# Altium schematic sheet volumes.SchDoc
size A
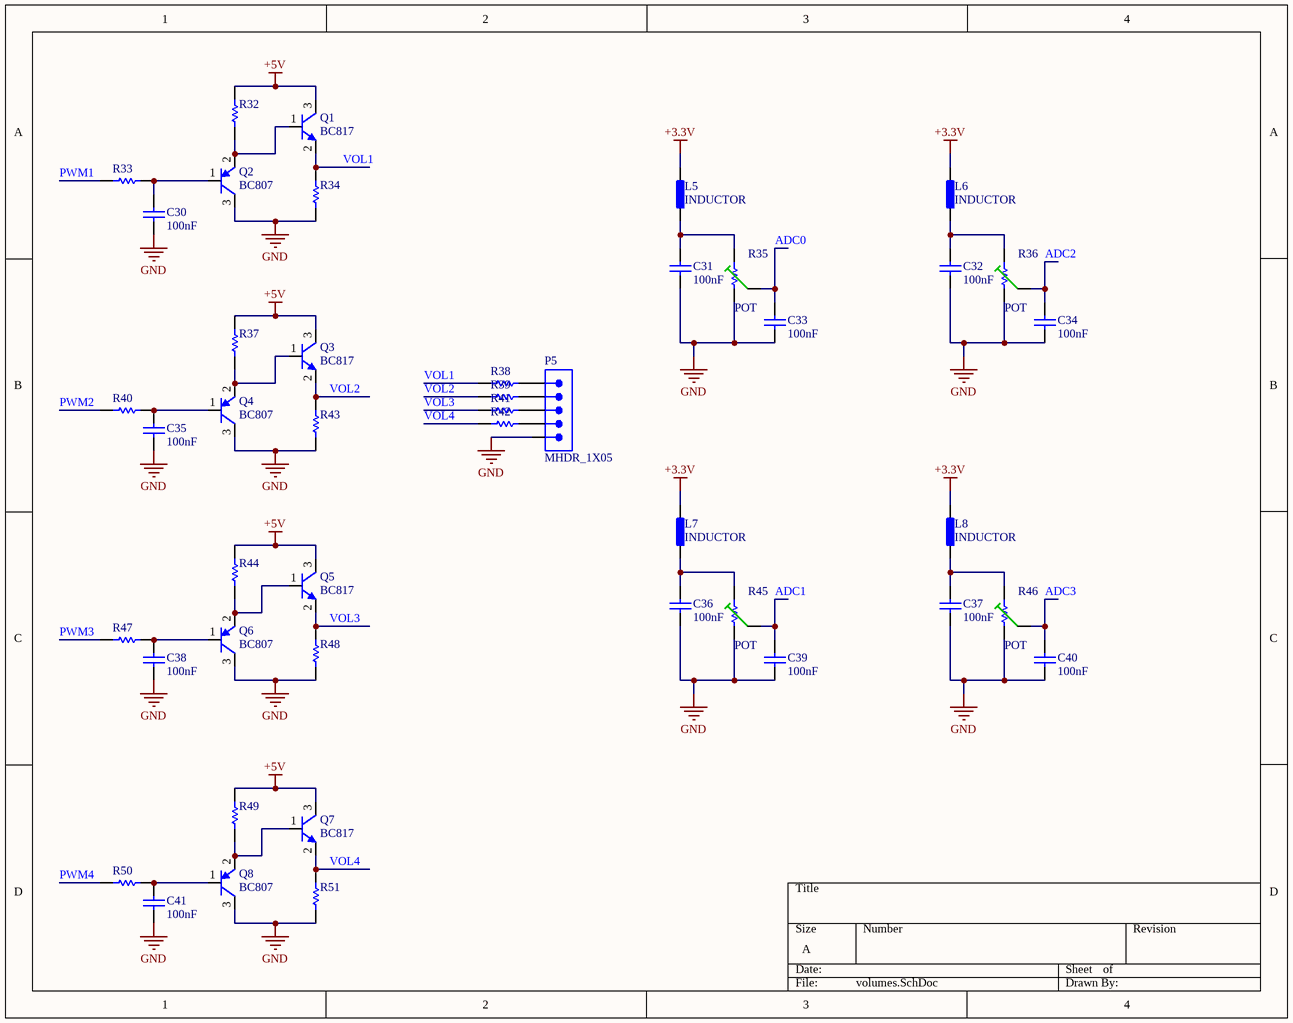
[diagram p0: volumes.SchDoc]

## Parts
C30  100nF  [CAPC3216M (1206)]
C31  100nF  [CAPC3216M (1206)]
C32  100nF  [CAPC3216M (1206)]
C33  100nF  [CAPC3216M (1206)]
C34  100nF  [CAPC3216M (1206)]
C35  100nF  [CAPC3216M (1206)]
C36  100nF  [CAPC3216M (1206)]
C37  100nF  [CAPC3216M (1206)]
C38  100nF  [CAPC3216M (1206)]
C39  100nF  [CAPC3216M (1206)]
C40  100nF  [CAPC3216M (1206)]
C41  100nF  [CAPC3216M (1206)]
L5  INDUCTOR  [INDC3216]
L6  INDUCTOR  [INDC3216]
L7  INDUCTOR  [INDC3216]
L8  INDUCTOR  [INDC3216]
P5  MHDR_1X05  [MHDR1X05-254P]
Q1  BC817  [SOT23_BEC_M]
Q2  BC807  [SOT23_BEC_M]
Q3  BC817  [SOT23_BEC_M]
Q4  BC807  [SOT23_BEC_M]
Q5  BC817  [SOT23_BEC_M]
Q6  BC807  [SOT23_BEC_M]
Q7  BC817  [SOT23_BEC_M]
Q8  BC807  [SOT23_BEC_M]
R32  1K  [RESC3216X60M (1206)]  (value not drawn)
R33  1K  [RESC3216X60M (1206)]  (value not drawn)
R34  1K  [RESC3216X60M (1206)]  (value not drawn)
R35  POT  [EVUF]
R36  POT  [EVUF]
R37  1K  [RESC3216X60M (1206)]  (value not drawn)
R38  1K  [RESC3216X60M (1206)]  (value not drawn)
R39  1K  [RESC3216X60M (1206)]  (value not drawn)
R40  1K  [RESC3216X60M (1206)]  (value not drawn)
R41  1K  [RESC3216X60M (1206)]  (value not drawn)
R42  1K  [RESC3216X60M (1206)]  (value not drawn)
R43  1K  [RESC3216X60M (1206)]  (value not drawn)
R44  1K  [RESC3216X60M (1206)]  (value not drawn)
R45  POT  [EVUF]
R46  POT  [EVUF]
R47  1K  [RESC3216X60M (1206)]  (value not drawn)
R48  1K  [RESC3216X60M (1206)]  (value not drawn)
R49  1K  [RESC3216X60M (1206)]  (value not drawn)
R50  1K  [RESC3216X60M (1206)]  (value not drawn)
R51  1K  [RESC3216X60M (1206)]  (value not drawn)

## Nets
+3.3V: L5.2 L6.2 L7.2 L8.2
+5V: Q1.3(C) Q3.3(C) Q5.3(C) Q7.3(C) R32.1 R37.1 R44.1 R49.1
GND: C30.2(-) C31.2(-) C32.2(-) C33.2(-) C34.2(-) C35.2(-) C36.2(-) C37.2(-) C38.2(-) C39.2(-) C40.2(-) C41.2(-) P5.5 Q2.3(C) Q4.3(C) Q6.3(C) Q8.3(C) R34.2 R35.3(CW) R36.3(CW) R43.2 R45.3(CW) R46.3(CW) R48.2 R51.2
ADC0: C33.1(+) R35.2(WIPER)
ADC1: C39.1(+) R45.2(WIPER)
ADC2: C34.1(+) R36.2(WIPER)
ADC3: C40.1(+) R46.2(WIPER)
PWM1: R33.2
PWM2: R40.2
PWM3: R47.2
PWM4: R50.2
VOL1: Q1.2(E) R34.1 R38.2
VOL2: Q3.2(E) R39.2 R43.1
VOL3: Q5.2(E) R41.2 R48.1
VOL4: Q7.2(E) R42.2 R51.1
NetC30_1: C30.1(+) Q2.1(B) R33.1
NetC31_1: C31.1(+) L5.1 R35.1(CCW)
NetC32_1: C32.1(+) L6.1 R36.1(CCW)
NetC35_1: C35.1(+) Q4.1(B) R40.1
NetC36_1: C36.1(+) L7.1 R45.1(CCW)
NetC37_1: C37.1(+) L8.1 R46.1(CCW)
NetC38_1: C38.1(+) Q6.1(B) R47.1
NetC41_1: C41.1(+) Q8.1(B) R50.1
NetP5_1: P5.1 R38.1
NetP5_2: P5.2 R39.1
NetP5_3: P5.3 R41.1
NetP5_4: P5.4 R42.1
NetQ1_1: Q1.1(B) Q2.2(E) R32.2
NetQ3_1: Q3.1(B) Q4.2(E) R37.2
NetQ5_1: Q5.1(B) Q6.2(E) R44.2
NetQ7_1: Q7.1(B) Q8.2(E) R49.2

## Library data of the parts
C30-C41 = CAP_Bipolar: Bipolar Capacitor; Voltage: 100V; Designer: Eng. Saeid Jorablo; Company: SJ Libraries; ComponentLink1Description: Datasheet; ComponentLink2Description: Reference; Publisher: SJ Unlimited; Mounting Technology: *; Mounting Technology: Surface Mount\Through-Hole; HelpURL: http://s3.picofile.com/file/7443264187/Coming_Soon_logo.gif; Status: Unreleased; Value: 100nF
L5-L8 = INDUCTOR: Code_IEC: 1005; Designer: Eng. Saeid Jorablo; Company: SJ Libraries; Value: 10mH; Published: 8-Jun-2000; LatestRevisionDate: 29-May-2009; LatestRevisionNote: IPC-7351 Footprint Added.; PackageReference: 0402-A; Publisher: SJ Unlimited; PackageDescription: Chip Inductor; Code_JEITA: 0402; ComponentLink1Description: Datasheet; ComponentLink2Description: Reference; Mounting Technology: Surface Mount\Through-Hole; HelpURL: http://s3.picofile.com/file/7443264187/Coming_Soon_logo.gif; Status: Unreleased
P5 = MHDR_1X05: Male Header 1X05
Q1 Q3 Q5 Q7 = NPN_BEC: NPN Bipolar Transistor; Designer: Eng. Saeid Jorablo; Company: SJ Libraries; Published: 8-Jun-2000; LatestRevisionDate: 29-May-2009; LatestRevisionNote: IPC-7351 Footprint Added.; PackageVersion: Aug-1999; PackageReference: SOT-23B; Publisher: SJ Unlimited; PackageDescription: 3-Pin SOT-23 Package 0.95 mm Pitch, 2.4 mm Lead Span; ComponentLink1Description: Datasheet; ComponentLink2Description: Reference; Mounting Technology: Surface Mount\Through-Hole; HelpURL: http://s3.picofile.com/file/7443264187/Coming_Soon_logo.gif; Status: Unreleased
Q2 Q4 Q6 Q8 = PNP_BEC: PNP Bipolar Transistor; Designer: Eng. Saeid Jorablo; Company: SJ Libraries; Published: 8-Jun-2000; LatestRevisionDate: 29-May-2009; LatestRevisionNote: IPC-7351 Footprint Added.; PackageVersion: Aug-1999; PackageReference: SOT-23B; Publisher: SJ Unlimited; PackageDescription: 3-Pin SOT-23 Package 0.95 mm Pitch, 2.4 mm Lead Span; ComponentLink1Description: Datasheet; ComponentLink2Description: Reference; Mounting Technology: Surface Mount\Through-Hole; HelpURL: http://s3.picofile.com/file/7443264187/Coming_Soon_logo.gif; Status: Unreleased
R32-R34 R37-R44 R47-R51 = RES: Resistor; Designer: Eng. Saeid Jorablo; Company: SJ Libraries; Tolerance: 5%; Power: 1/8 W; Category: Resistors; ComponentLink1Description: Datasheet; ComponentLink2Description: Reference; PackageDescription: SMD & TH Resistors; Publisher: SJ Unlimited; Mounting Technology: Surface Mount\Through-Hole; HelpURL: http://s3.picofile.com/file/7443264187/Coming_Soon_logo.gif; Status: Unreleased; Value: 1K
R35 R36 R45 R46 = RES_POT_LIN